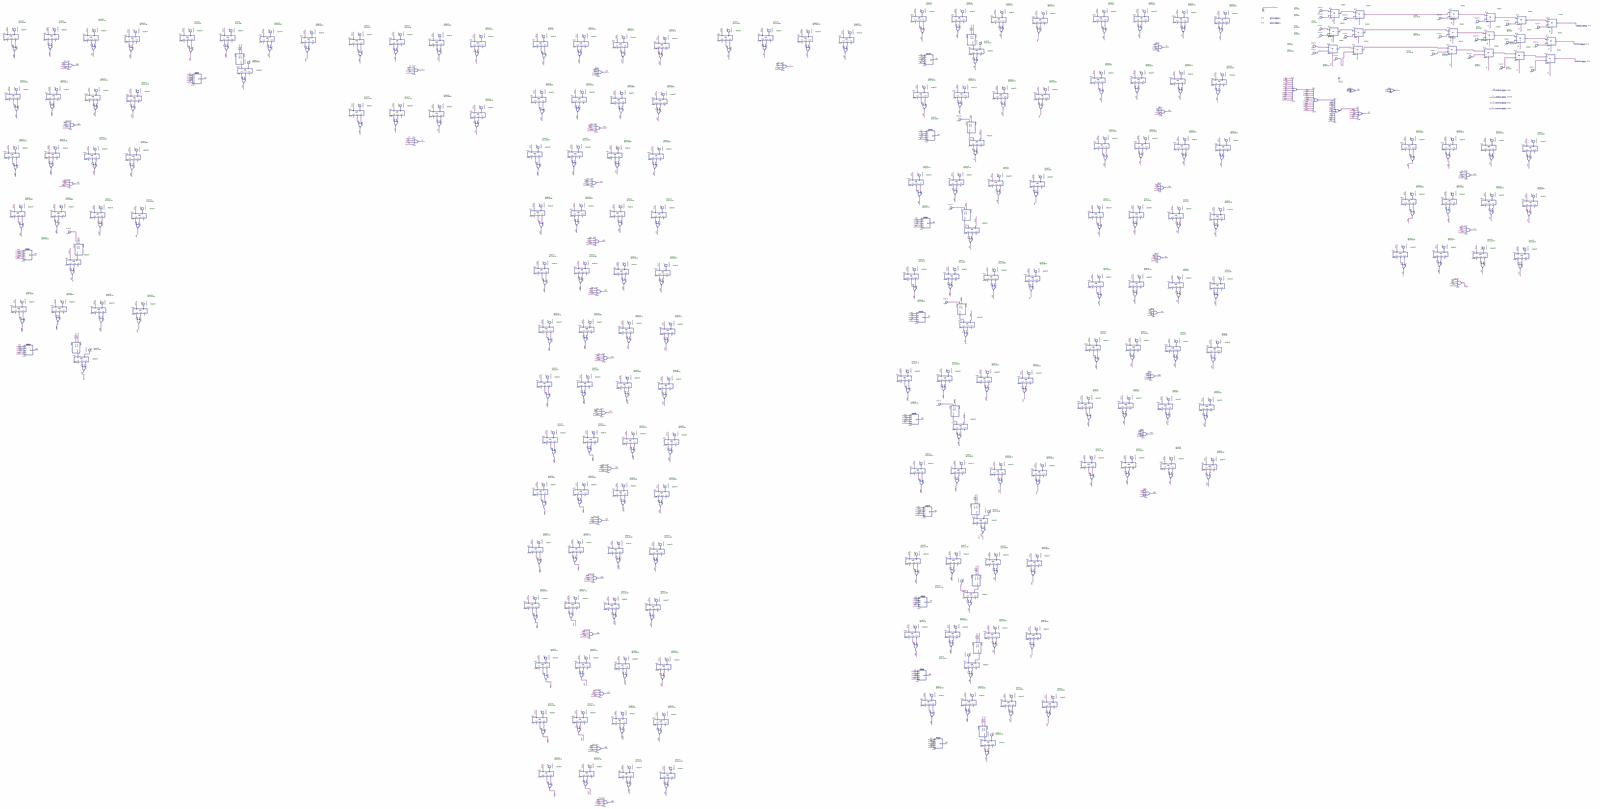
[diagram p0: schematic sheet, whole]
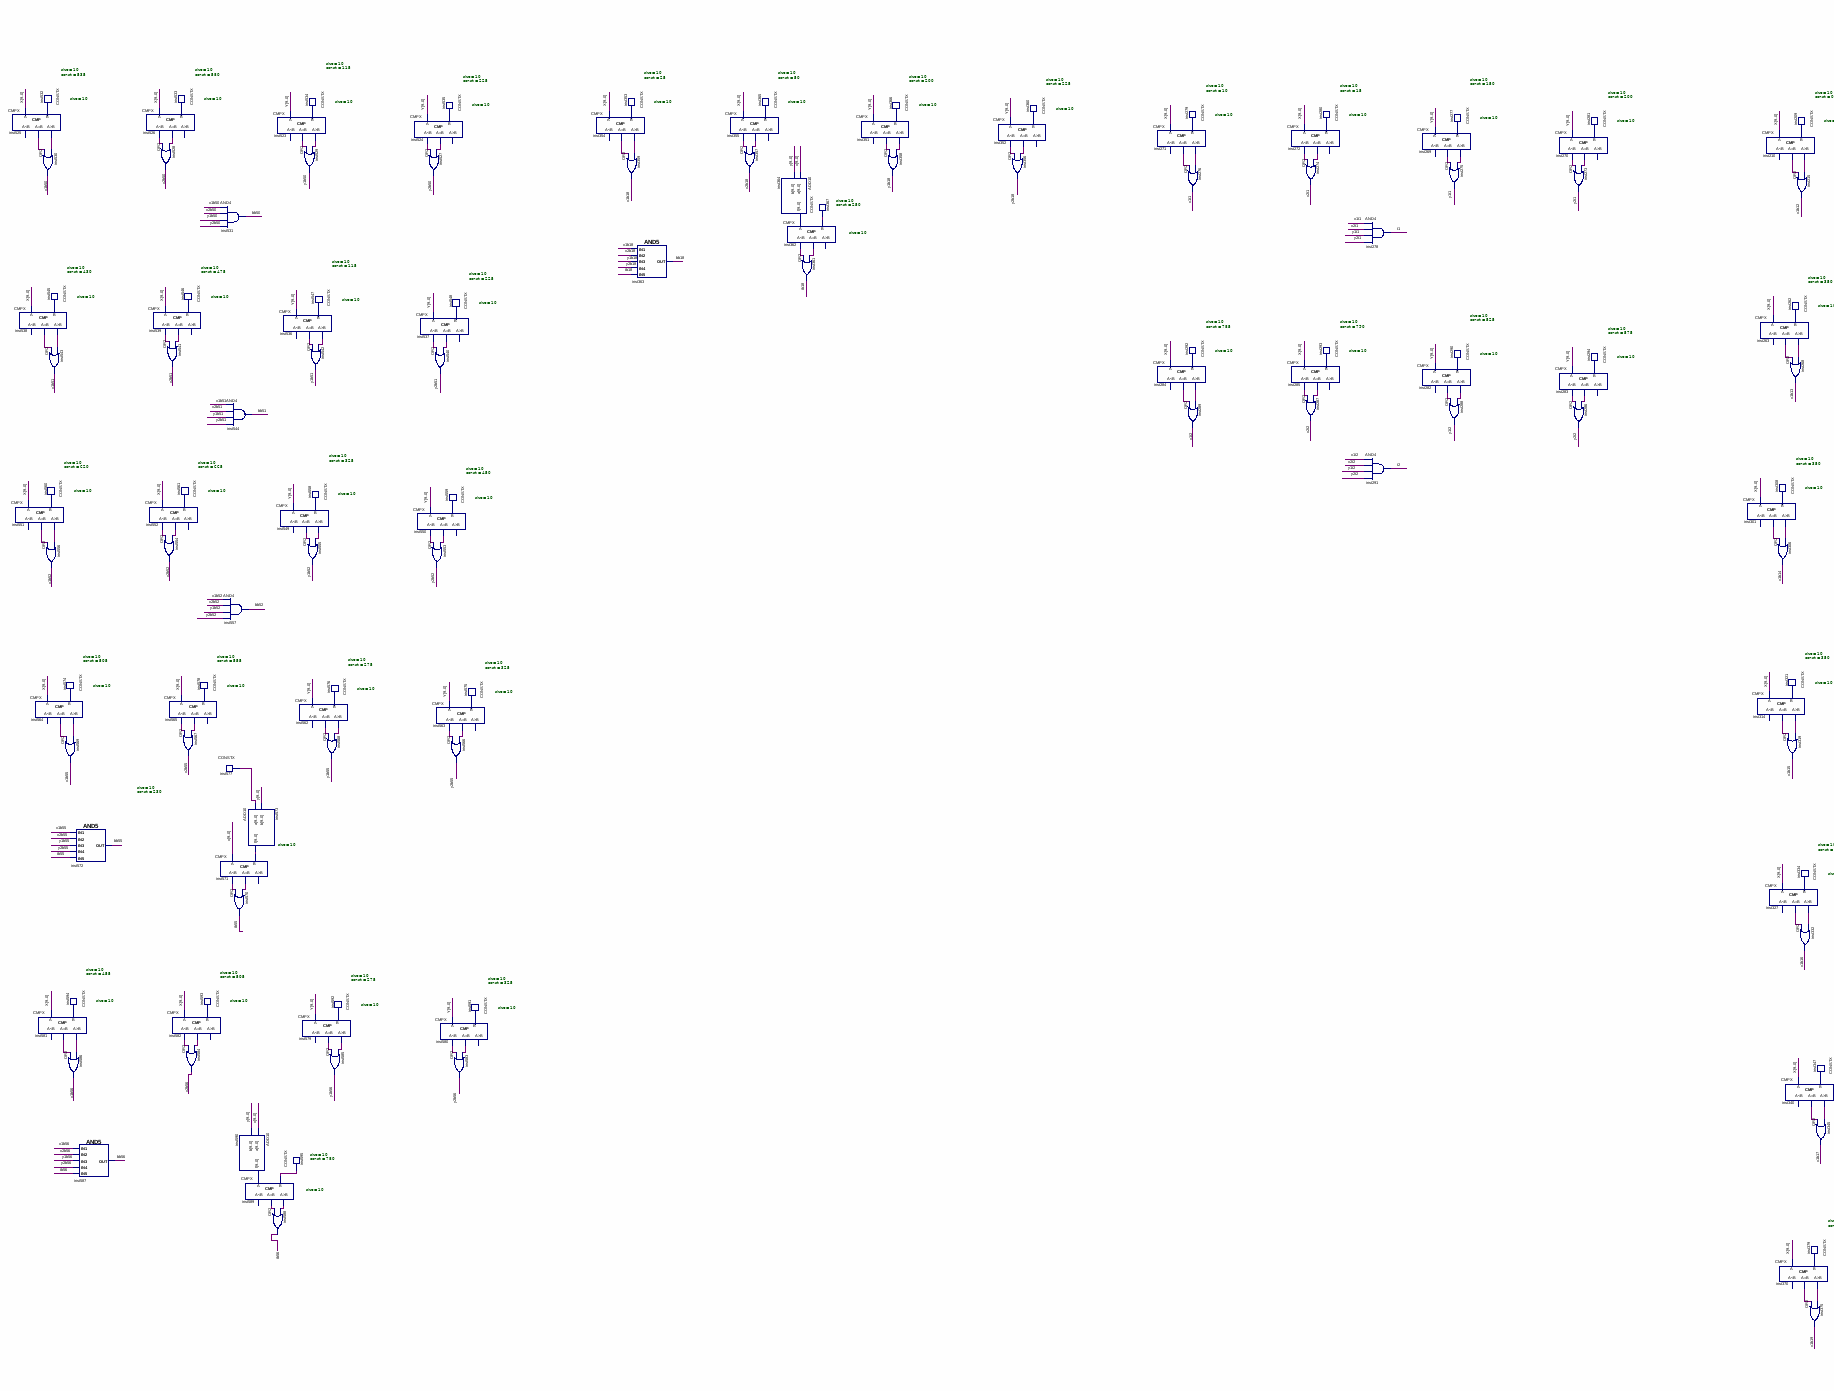
[diagram p1: schematic sheet, upper left part]
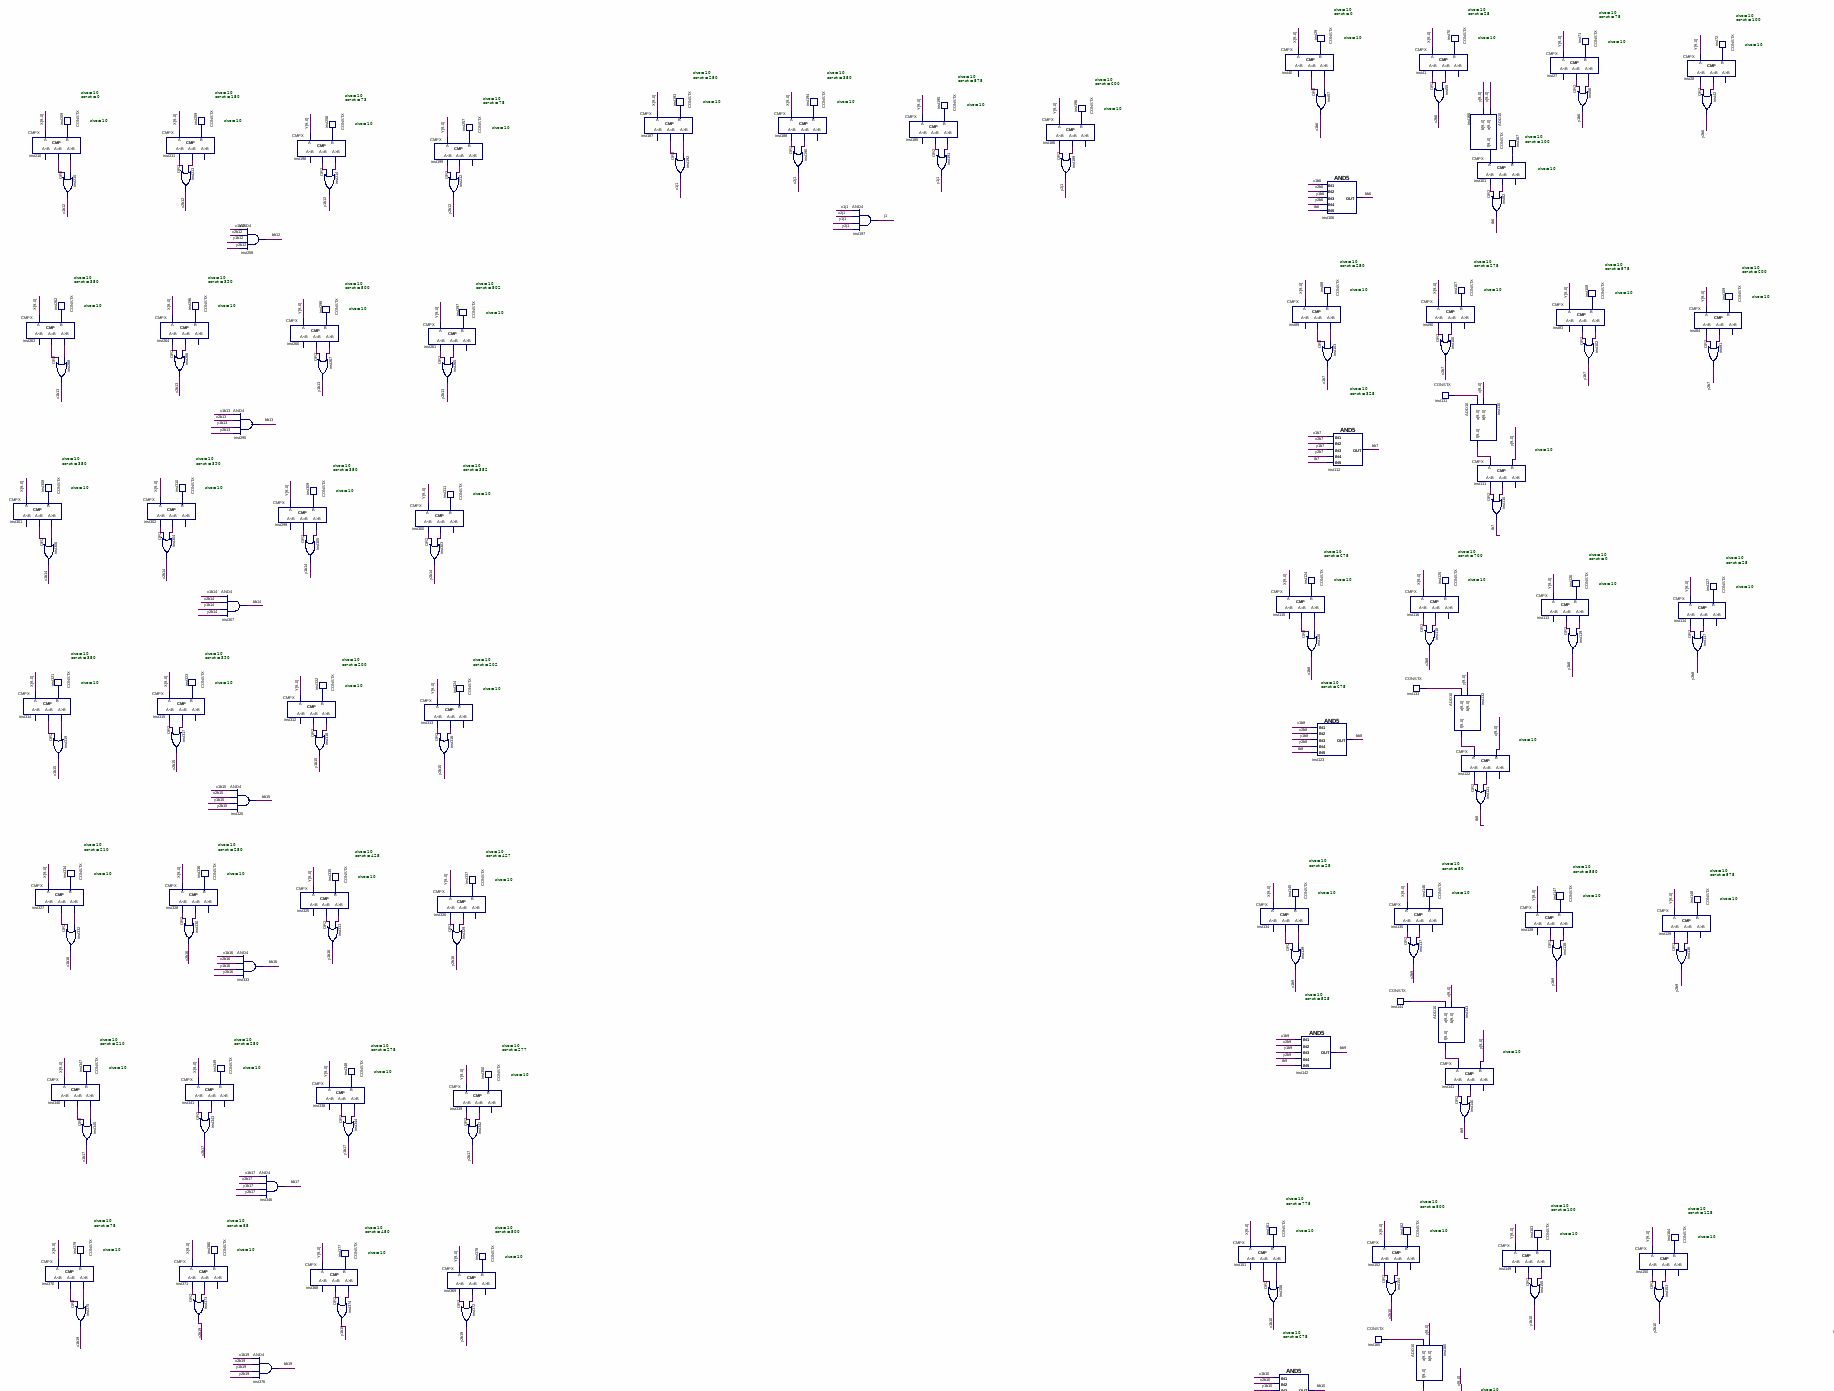
[diagram p2: schematic sheet, upper centre part]
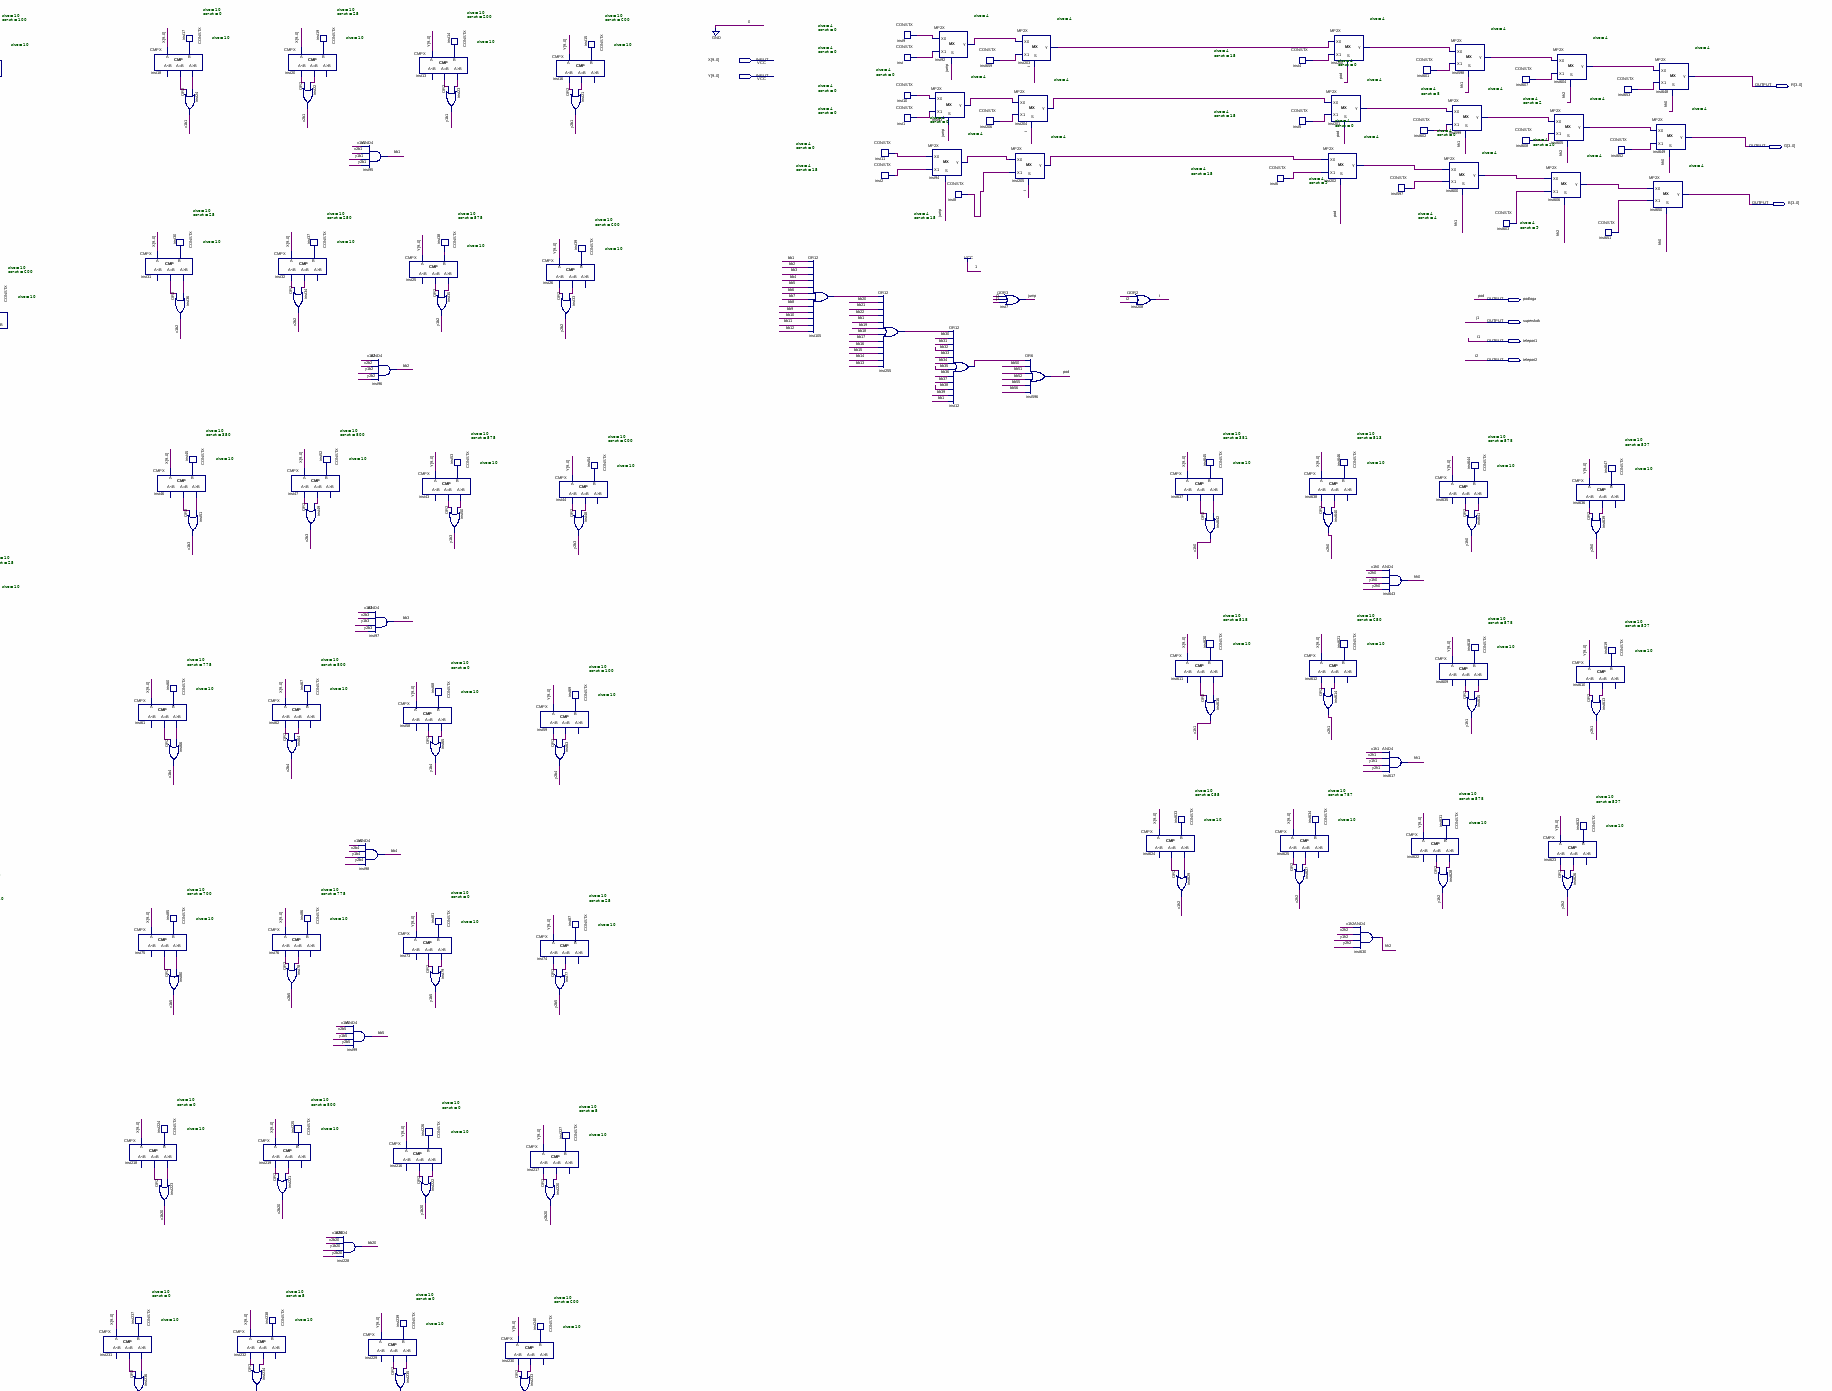
[diagram p3: schematic sheet, upper right part]
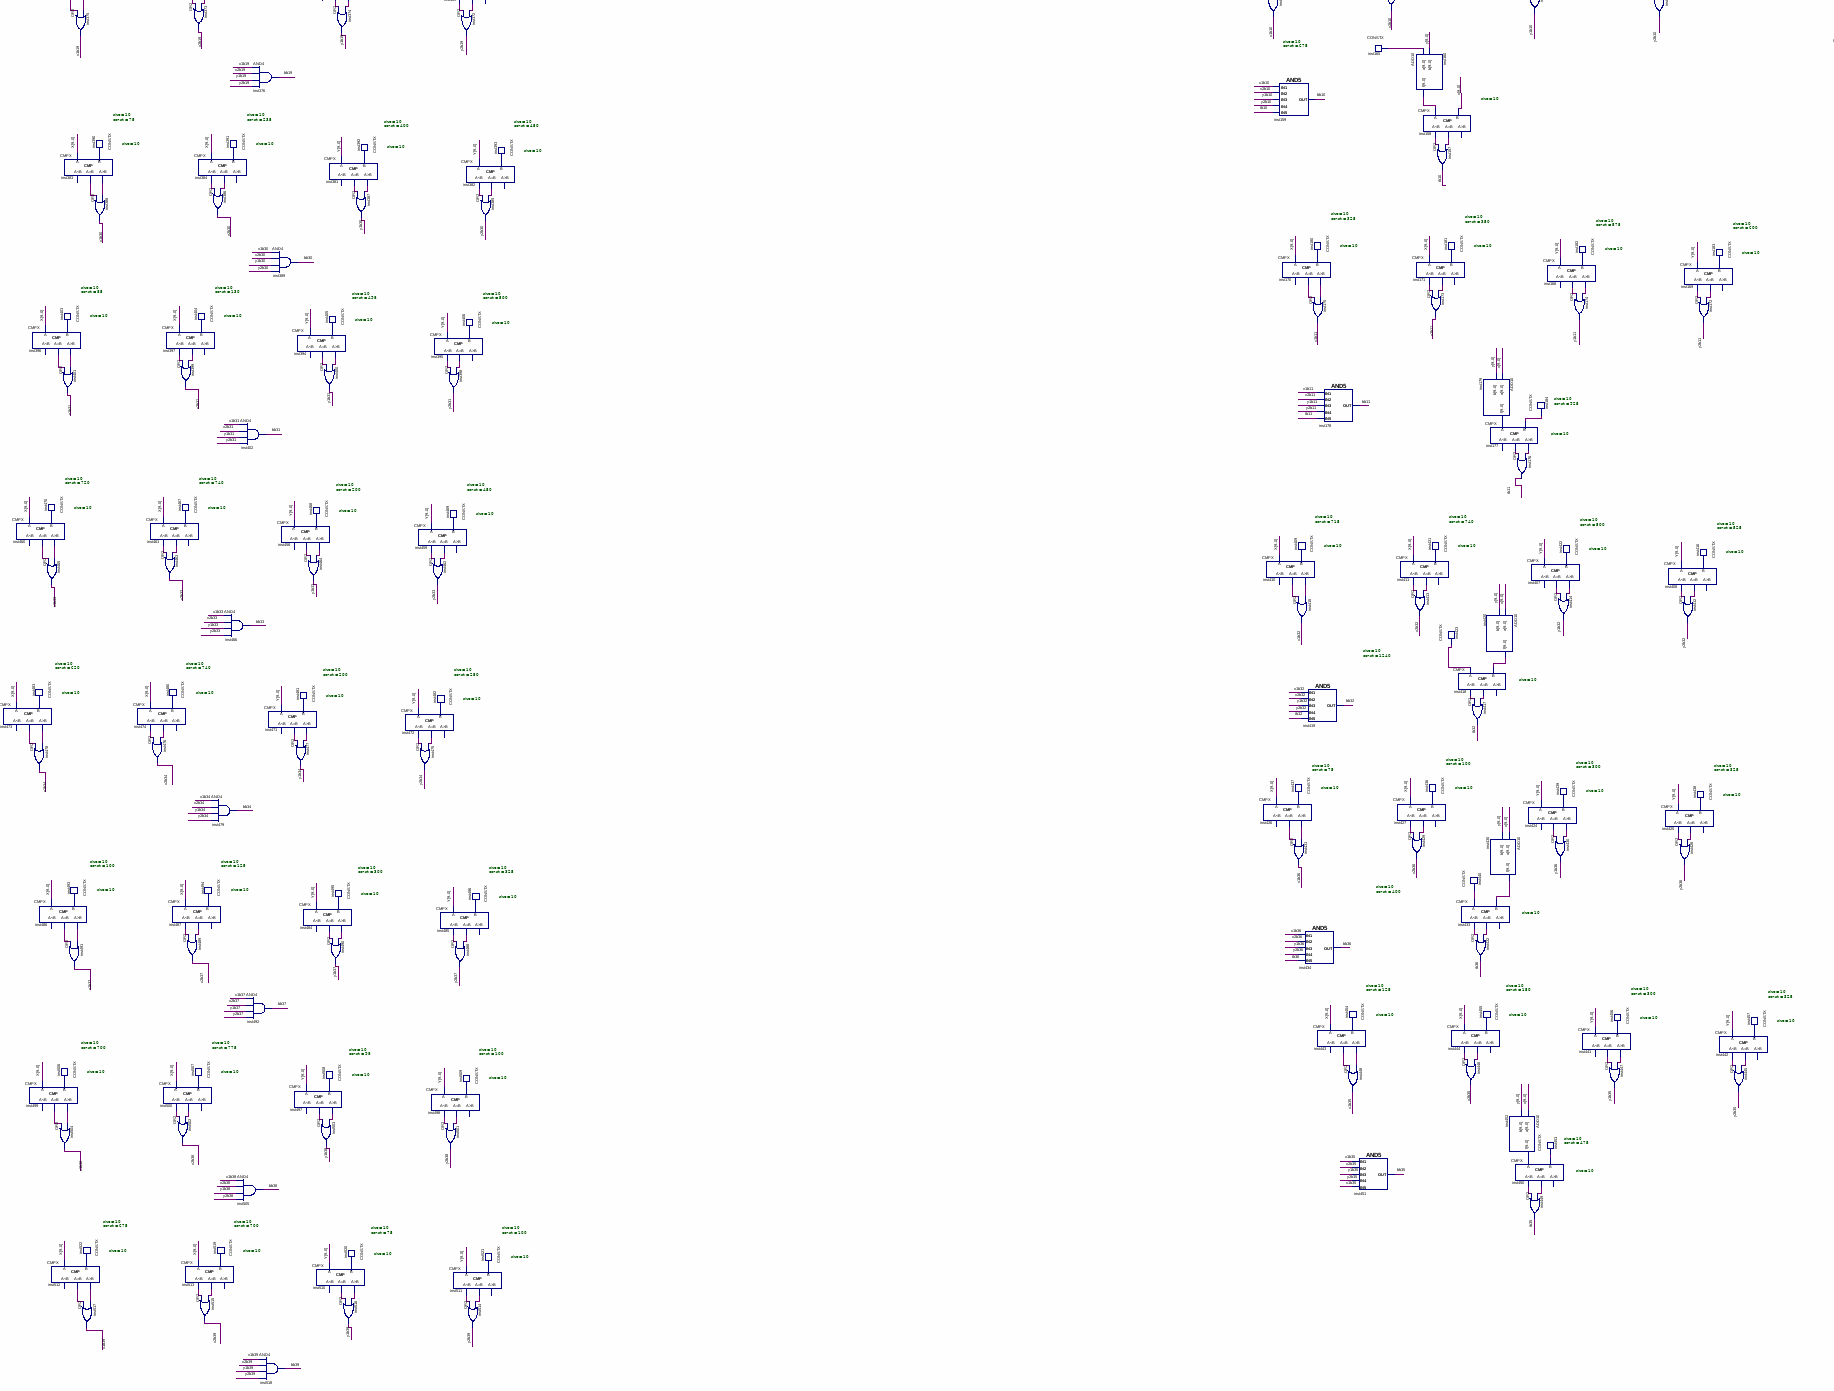
[diagram p4: schematic sheet, lower centre part]
// Quartus schematic Layer0.bdf as structural Verilog: 652 symbols, 9 pins
module Layer0 (
  input  [9:0] X,
  input  [9:0] Y,
  output [3:0] R,
  output [3:0] G,
  output [3:0] B,
  output podloga,
  output superskok,
  output teleport1,
  output teleport2
);

  wire bb1, bb2, bb3, bb4, bb5, bb6, bb7, bb8, bb9, bb10, bb11, bb12, bb13, bb14, bb15, bb16, bb17, bb18,
       bb19, bb20, bb21, bb22, bb30, bb31, bb32, bb33, bb34, bb35, bb36, bb37, bb38, bb39, bb50, bb51, bb52,
       bb55, bb56, hh0, hh1, hh2, inst12_out, inst13_eq, inst13_gr, inst16_eq, inst16_ls, inst18_eq,
       inst18_gr, inst20_eq, inst20_ls, inst25_eq, inst25_gr, inst26_eq, inst26_ls, inst27_eq, inst27_gr,
       inst28_eq, inst28_ls, inst31_eq, inst31_gr, inst32_eq, inst32_ls, inst40_eq, inst40_gr, inst41_eq,
       inst41_ls, inst43_eq, inst43_gr, inst44_eq, inst44_ls, inst46_eq, inst46_gr, inst47_eq, inst47_ls,
       inst58_eq, inst58_gr, inst59_eq, inst59_ls, inst61_eq, inst61_gr, inst62_eq, inst62_ls, inst73_eq,
       inst73_gr, inst74_eq, inst74_ls, inst75_eq, inst75_gr, inst76_eq, inst76_ls, inst83_eq, inst83_gr,
       inst84_eq, inst84_ls, inst89_eq, inst89_gr, inst90_eq, inst90_ls, inst101_eq, inst101_ls, inst105_out,
       inst111_eq, inst111_ls, inst113_eq, inst113_gr, inst114_eq, inst114_ls, inst115_eq, inst115_gr,
       inst116_eq, inst116_ls, inst122_eq, inst122_ls, inst128_eq, inst128_gr, inst129_eq, inst129_ls,
       inst134_eq, inst134_gr, inst135_eq, inst135_ls, inst141_eq, inst141_ls, inst149_eq, inst149_gr,
       inst150_eq, inst150_ls, inst151_eq, inst151_gr, inst152_eq, inst152_ls, inst158_eq, inst158_ls,
       inst168_eq, inst168_gr, inst169_eq, inst169_ls, inst170_eq, inst170_gr, inst171_eq, inst171_ls,
       inst177_eq, inst177_gr, inst185_eq, inst185_gr, inst186_eq, inst186_ls, inst187_eq, inst187_gr,
       inst188_eq, inst188_ls, inst198_eq, inst198_gr, inst199_eq, inst199_ls, inst210_eq, inst210_gr,
       inst211_eq, inst211_ls, inst216_eq, inst216_gr, inst217_eq, inst217_ls, inst218_eq, inst218_gr,
       inst219_eq, inst219_ls, inst229_eq, inst229_gr, inst230_eq, inst230_ls, inst231_eq, inst231_gr,
       inst232_eq, inst232_ls, inst242_eq, inst242_gr, inst243_eq, inst243_ls, inst244_eq, inst244_gr,
       inst245_eq, inst245_ls, inst255_out, inst260_eq, inst260_gr, inst261_eq, inst261_ls, inst263_eq,
       inst263_gr, inst264_eq, inst264_ls, inst269_eq, inst269_gr, inst270_eq, inst270_ls, inst271_eq,
       inst271_gr, inst272_eq, inst272_ls, inst282_eq, inst282_gr, inst283_eq, inst283_ls, inst284_eq,
       inst284_gr, inst285_eq, inst285_ls, inst299_eq, inst299_gr, inst300_eq, inst300_ls, inst301_eq,
       inst301_gr, inst302_eq, inst302_ls, inst312_eq, inst312_gr, inst313_eq, inst313_ls, inst314_eq,
       inst314_gr, inst315_eq, inst315_ls, inst325_eq, inst325_gr, inst326_eq, inst326_ls, inst327_eq,
       inst327_gr, inst328_eq, inst328_ls, inst338_eq, inst338_gr, inst339_eq, inst339_ls, inst340_eq,
       inst340_gr, inst341_eq, inst341_ls, inst351_eq, inst351_gr, inst352_eq, inst352_ls, inst354_eq,
       inst354_gr, inst355_eq, inst355_ls, inst362_eq, inst362_ls, inst368_eq, inst368_gr, inst369_eq,
       inst369_ls, inst370_eq, inst370_gr, inst371_eq, inst371_ls, inst381_eq, inst381_gr, inst382_eq,
       inst382_ls, inst383_eq, inst383_gr, inst384_eq, inst384_ls, inst394_eq, inst394_gr, inst395_eq,
       inst395_ls, inst396_eq, inst396_gr, inst397_eq, inst397_ls, inst407_eq, inst407_gr, inst408_eq,
       inst408_ls, inst410_eq, inst410_gr, inst411_eq, inst411_ls, inst418_eq, inst418_ls, inst424_eq,
       inst424_gr, inst425_eq, inst425_ls, inst426_eq, inst426_gr, inst427_eq, inst427_ls, inst433_eq,
       inst433_ls, inst441_eq, inst441_gr, inst442_eq, inst442_ls, inst443_eq, inst443_gr, inst444_eq,
       inst444_ls, inst450_eq, inst450_ls, inst458_eq, inst458_gr, inst459_eq, inst459_ls, inst460_eq,
       inst460_gr, inst461_eq, inst461_ls, inst471_eq, inst471_gr, inst472_eq, inst472_ls, inst473_eq,
       inst473_gr, inst474_eq, inst474_ls, inst484_eq, inst484_gr, inst485_eq, inst485_ls, inst486_eq,
       inst486_gr, inst487_eq, inst487_ls, inst497_eq, inst497_gr, inst498_eq, inst498_ls, inst499_eq,
       inst499_gr, inst500_eq, inst500_ls, inst510_eq, inst510_gr, inst511_eq, inst511_ls, inst512_eq,
       inst512_gr, inst513_eq, inst513_ls, inst523_eq, inst523_gr, inst524_eq, inst524_ls, inst525_eq,
       inst525_gr, inst526_eq, inst526_ls, inst536_eq, inst536_gr, inst537_eq, inst537_ls, inst538_eq,
       inst538_gr, inst539_eq, inst539_ls, inst549_eq, inst549_gr, inst550_eq, inst550_ls, inst551_eq,
       inst551_gr, inst552_eq, inst552_ls, inst562_eq, inst562_gr, inst563_eq, inst563_ls, inst564_eq,
       inst564_gr, inst565_eq, inst565_ls, inst571_eq, inst571_ls, inst579_eq, inst579_gr, inst580_eq,
       inst580_ls, inst581_eq, inst581_gr, inst582_eq, inst582_ls, inst589_eq, inst589_gr, inst609_eq,
       inst609_gr, inst610_eq, inst610_ls, inst611_eq, inst611_gr, inst612_eq, inst612_ls, inst622_eq,
       inst622_gr, inst623_eq, inst623_ls, inst624_eq, inst624_gr, inst625_eq, inst625_ls, inst635_eq,
       inst635_gr, inst636_eq, inst636_ls, inst637_eq, inst637_gr, inst638_eq, inst638_ls, jump, t, tb6, tb7,
       tb8, tb9, tb10, tb11, tb18, tb32, tb35, tb36, tb55, tb56, x1b1, x1b2, x1b3, x1b4, x1b5, x1b6, x1b7,
       x1b8, x1b9, x1b10, x1b11, x1b12, x1b13, x1b14, x1b15, x1b16, x1b17, x1b18, x1b19, x1b20, x1b21, x1b22,
       x1b30, x1b31, x1b32, x1b33, x1b34, x1b35, x1b36, x1b37, x1b38, x1b39, x1b50, x1b51, x1b52, x1b55,
       x1b56, x1h0, x1h1, x1h2, x1j1, x1t1, x1t2, x2b1, x2b2, x2b3, x2b4, x2b5, x2b6, x2b7, x2b8, x2b9,
       x2b10, x2b11, x2b12, x2b13, x2b14, x2b15, x2b16, x2b17, x2b18, x2b19, x2b20, x2b21, x2b22, x2b30,
       x2b31, x2b32, x2b33, x2b34, x2b35, x2b36, x2b37, x2b38, x2b39, x2b50, x2b51, x2b52, x2b55, x2b56,
       x2h0, x2h1, x2h2, x2j1, x2t1, x2t2, y1b1, y1b2, y1b3, y1b4, y1b5, y1b6, y1b7, y1b8, y1b9, y1b10,
       y1b11, y1b12, y1b13, y1b14, y1b15, y1b16, y1b17, y1b18, y1b19, y1b20, y1b21, y1b22, y1b30, y1b31,
       y1b32, y1b33, y1b34, y1b35, y1b36, y1b37, y1b38, y1b39, y1b50, y1b51, y1b52, y1b55, y1b56, y1h0, y1h1,
       y1h2, y1j1, y1t1, y1t2, y2b1, y2b2, y2b3, y2b4, y2b5, y2b6, y2b7, y2b8, y2b9, y2b10, y2b11, y2b12,
       y2b13, y2b14, y2b15, y2b16, y2b17, y2b18, y2b19, y2b20, y2b21, y2b22, y2b30, y2b31, y2b32, y2b33,
       y2b34, y2b35, y2b36, y2b37, y2b38, y2b39, y2b50, y2b51, y2b52, y2b55, y2b56, y2h0, y2h1, y2h2, y2j1,
       y2t1, y2t2;
  wire [3:0] inst1_data, inst2_data, inst4_data, inst5_data, inst6_data, inst8_data, inst9_data, inst10_data,
       inst11_data, inst92_y, inst93_y, inst94_y, inst200_y, inst201_y, inst202_y, inst203_y, inst204_y,
       inst205_y, inst206_data, inst597_data, inst598_y, inst599_y, inst600_y, inst601_data, inst602_data,
       inst603_data, inst604_y, inst605_y, inst606_y, inst607_data, inst608_data, inst651_data, inst652_data,
       inst653_data, inst659_data, inst_data;
  wire [9:0] inst14_data, inst15_data, inst17_data, inst19_data, inst29_data, inst30_data, inst37_data,
       inst38_data, inst39_data, inst45_data, inst52_data, inst53_data, inst54_data, inst60_data,
       inst67_data, inst68_data, inst69_data, inst70_data, inst71_data, inst72_data, inst81_data,
       inst85_data, inst86_data, inst87_data, inst88_data, inst107_data, inst108_data, inst109_data,
       inst124_data, inst125_data, inst126_data, inst127_data, inst130_f, inst131_data, inst132_f,
       inst133_data, inst143_f, inst144_data, inst145_data, inst146_data, inst147_data, inst148_data,
       inst160_f, inst161_data, inst162_data, inst163_data, inst164_data, inst165_data, inst166_f,
       inst167_data, inst179_f, inst180_data, inst181_data, inst182_data, inst183_data, inst184_data,
       inst193_data, inst194_data, inst195_data, inst196_data, inst209_data, inst224_data, inst225_data,
       inst226_data, inst227_data, inst237_data, inst238_data, inst239_data, inst240_data, inst250_data,
       inst251_data, inst252_data, inst253_data, inst256_data, inst257_data, inst259_data, inst262_data,
       inst277_data, inst279_data, inst280_data, inst281_data, inst290_data, inst292_data, inst293_data,
       inst294_data, inst296_data, inst297_data, inst298_data, inst308_data, inst309_data, inst310_data,
       inst311_data, inst321_data, inst322_data, inst323_data, inst324_data, inst334_data, inst335_data,
       inst336_data, inst337_data, inst347_data, inst348_data, inst349_data, inst350_data, inst353_data,
       inst360_data, inst364_f, inst365_data, inst366_data, inst367_data, inst377_data, inst378_data,
       inst379_data, inst380_data, inst390_data, inst391_data, inst392_data, inst393_data, inst403_data,
       inst404_data, inst405_data, inst406_data, inst409_data, inst416_data, inst420_f, inst421_data,
       inst422_data, inst423_data, inst435_f, inst436_data, inst437_data, inst438_data, inst439_data,
       inst440_data, inst452_f, inst453_data, inst454_data, inst455_data, inst456_data, inst457_data,
       inst467_data, inst468_data, inst469_data, inst470_data, inst480_data, inst481_data, inst482_data,
       inst483_data, inst493_data, inst494_data, inst495_data, inst496_data, inst506_data, inst507_data,
       inst508_data, inst509_data, inst519_data, inst520_data, inst521_data, inst522_data, inst532_data,
       inst533_data, inst534_data, inst535_data, inst545_data, inst546_data, inst547_data, inst548_data,
       inst558_data, inst559_data, inst560_data, inst561_data, inst573_f, inst574_data, inst575_data,
       inst576_data, inst577_data, inst578_data, inst590_f, inst591_data, inst592_data, inst593_data,
       inst594_data, inst595_data, inst618_data, inst619_data, inst620_data, inst621_data, inst631_data,
       inst632_data, inst633_data, inst634_data, inst644_data, inst645_data, inst646_data, inst647_data;

  CMPX #(.size(10)) inst525 (.A(X), .B(inst532_data), .eq(inst525_eq), .gr(inst525_gr));  // open: ls
  CMPX #(.size(10)) inst538 (.A(X), .B(inst545_data), .eq(inst538_eq), .gr(inst538_gr));  // open: ls
  CMPX #(.size(10)) inst551 (.A(X), .B(inst560_data), .eq(inst551_eq), .gr(inst551_gr));  // open: ls
  CONSTX #(.size(10), .\const (535)) inst532 (.data(inst532_data));
  or inst530 (x1b50, inst525_eq, inst525_gr);
  CONSTX #(.size(10), .\const (430)) inst545 (.data(inst545_data));
  or inst543 (x1b51, inst538_eq, inst538_gr);
  CONSTX #(.size(10), .\const (620)) inst560 (.data(inst560_data));
  or inst556 (x1b52, inst551_eq, inst551_gr);
  CMPX #(.size(10)) inst564 (.A(X), .B(inst574_data), .eq(inst564_eq), .gr(inst564_gr));  // open: ls
  CMPX #(.size(10)) inst581 (.A(X), .B(inst594_data), .eq(inst581_eq), .gr(inst581_gr));  // open: ls
  CONSTX #(.size(10), .\const (505)) inst574 (.data(inst574_data));
  or inst569 (x1b55, inst564_eq, inst564_gr);
  and inst572 (bb55, x1b55, x2b55, y1b55, y2b55, tb55);
  CONSTX #(.size(10), .\const (455)) inst594 (.data(inst594_data));
  or inst586 (x1b56, inst581_eq, inst581_gr);
  and inst587 (bb56, x1b56, x2b56, y1b56, y2b56, tb56);
  CMPX #(.size(10)) inst526 (.A(X), .B(inst533_data), .ls(inst526_ls), .eq(inst526_eq));  // open: gr
  CMPX #(.size(10)) inst539 (.A(X), .B(inst546_data), .ls(inst539_ls), .eq(inst539_eq));  // open: gr
  CMPX #(.size(10)) inst552 (.A(X), .B(inst561_data), .ls(inst552_ls), .eq(inst552_eq));  // open: gr
  CONSTX #(.size(10), .\const (580)) inst533 (.data(inst533_data));
  or inst528 (x2b50, inst526_ls, inst526_eq);
  or inst541 (x2b51, inst539_ls, inst539_eq);
  or inst554 (x2b52, inst552_ls, inst552_eq);
  CMPX #(.size(10)) inst565 (.A(X), .B(inst578_data), .ls(inst565_ls), .eq(inst565_eq));  // open: gr
  CMPX #(.size(10)) inst582 (.A(X), .B(inst593_data), .ls(inst582_ls), .eq(inst582_eq));  // open: gr
  CONSTX #(.size(10), .\const (475)) inst546 (.data(inst546_data));
  CONSTX #(.size(10), .\const (665)) inst561 (.data(inst561_data));
  CONSTX #(.size(10), .\const (555)) inst578 (.data(inst578_data));
  or inst567 (x2b55, inst565_ls, inst565_eq);
  CONSTX #(.size(10), .\const (505)) inst593 (.data(inst593_data));
  or inst584 (x2b56, inst582_ls, inst582_eq);
  and inst531 (bb50, x1b50, x2b50, y1b50, y2b50);
  and inst557 (bb52, x1b52, x2b52, y1b52, y2b52);
  CONSTX #(.size(10), .\const (230)) inst577 (.data(inst577_data));
  CMPX #(.size(10)) inst571 (.A(X), .B(inst573_f), .ls(inst571_ls), .eq(inst571_eq));  // open: gr
  and inst544 (bb51, x1b51, x2b51, y1b51, y2b51);
  ADD10 inst573 (.a(inst577_data), .b(Y), .f(inst573_f));
  or inst570 (tb55, inst571_ls, inst571_eq);
  ADD10 inst590 (.a(X), .b(Y), .f(inst590_f));
  CMPX #(.size(10)) inst589 (.A(inst590_f), .B(inst595_data), .eq(inst589_eq), .gr(inst589_gr));  // open: ls
  CMPX #(.size(10)) inst523 (.A(Y), .B(inst534_data), .eq(inst523_eq), .gr(inst523_gr));  // open: ls
  CMPX #(.size(10)) inst549 (.A(Y), .B(inst558_data), .eq(inst549_eq), .gr(inst549_gr));  // open: ls
  or inst588 (tb56, inst589_eq, inst589_gr);
  or inst529 (y1b50, inst523_eq, inst523_gr);
  CMPX #(.size(10)) inst536 (.A(Y), .B(inst547_data), .eq(inst536_eq), .gr(inst536_gr));  // open: ls
  CMPX #(.size(10)) inst562 (.A(Y), .B(inst576_data), .eq(inst562_eq), .gr(inst562_gr));  // open: ls
  CMPX #(.size(10)) inst579 (.A(Y), .B(inst592_data), .eq(inst579_eq), .gr(inst579_gr));  // open: ls
  CONSTX #(.size(10), .\const (780)) inst595 (.data(inst595_data));
  CONSTX #(.size(10), .\const (115)) inst534 (.data(inst534_data));
  CONSTX #(.size(10), .\const (115)) inst547 (.data(inst547_data));
  or inst542 (y1b51, inst536_eq, inst536_gr);
  CONSTX #(.size(10), .\const (325)) inst558 (.data(inst558_data));
  or inst555 (y1b52, inst549_eq, inst549_gr);
  CONSTX #(.size(10), .\const (275)) inst576 (.data(inst576_data));
  or inst568 (y1b55, inst562_eq, inst562_gr);
  or inst585 (y1b56, inst579_eq, inst579_gr);
  CONSTX #(.size(10), .\const (275)) inst592 (.data(inst592_data));
  CMPX #(.size(10)) inst524 (.A(Y), .B(inst535_data), .ls(inst524_ls), .eq(inst524_eq));  // open: gr
  or inst527 (y2b50, inst524_ls, inst524_eq);
  CMPX #(.size(10)) inst537 (.A(Y), .B(inst548_data), .ls(inst537_ls), .eq(inst537_eq));  // open: gr
  CMPX #(.size(10)) inst550 (.A(Y), .B(inst559_data), .ls(inst550_ls), .eq(inst550_eq));  // open: gr
  or inst553 (y2b52, inst550_ls, inst550_eq);
  CONSTX #(.size(10), .\const (225)) inst535 (.data(inst535_data));
  CONSTX #(.size(10), .\const (225)) inst548 (.data(inst548_data));
  or inst540 (y2b51, inst537_ls, inst537_eq);
  CONSTX #(.size(10), .\const (450)) inst559 (.data(inst559_data));
  CMPX #(.size(10)) inst563 (.A(Y), .B(inst575_data), .ls(inst563_ls), .eq(inst563_eq));  // open: gr
  or inst566 (y2b55, inst563_ls, inst563_eq);
  CMPX #(.size(10)) inst580 (.A(Y), .B(inst591_data), .ls(inst580_ls), .eq(inst580_eq));  // open: gr
  or inst583 (y2b56, inst580_ls, inst580_eq);
  CONSTX #(.size(10), .\const (325)) inst575 (.data(inst575_data));
  CONSTX #(.size(10), .\const (325)) inst591 (.data(inst591_data));
  CMPX #(.size(10)) inst354 (.A(X), .B(inst353_data), .eq(inst354_eq), .gr(inst354_gr));  // open: ls
  CONSTX #(.size(10), .\const (25)) inst353 (.data(inst353_data));
  or inst359 (x1b18, inst354_eq, inst354_gr);
  and inst363 (bb18, x1b18, x2b18, y1b18, y2b18, tb18);
  CMPX #(.size(10)) inst355 (.A(X), .B(inst365_data), .ls(inst355_ls), .eq(inst355_eq));  // open: gr
  CONSTX #(.size(10), .\const (50)) inst365 (.data(inst365_data));
  or inst357 (x2b18, inst355_ls, inst355_eq);
  ADD10 inst364 (.a(X), .b(Y), .f(inst364_f));
  CMPX #(.size(10)) inst362 (.A(inst364_f), .B(inst367_data), .ls(inst362_ls), .eq(inst362_eq));  // open: gr
  CONSTX #(.size(10), .\const (250)) inst367 (.data(inst367_data));
  or inst361 (tb18, inst362_ls, inst362_eq);
  CMPX #(.size(10)) inst351 (.A(Y), .B(inst366_data), .eq(inst351_eq), .gr(inst351_gr));  // open: ls
  CONSTX #(.size(10), .\const (200)) inst366 (.data(inst366_data));
  or inst358 (y1b18, inst351_eq, inst351_gr);
  CMPX #(.size(10)) inst352 (.A(Y), .B(inst360_data), .ls(inst352_ls), .eq(inst352_eq));  // open: gr
  or inst356 (y2b18, inst352_ls, inst352_eq);
  CONSTX #(.size(10), .\const (225)) inst360 (.data(inst360_data));
  CMPX #(.size(10)) inst271 (.A(X), .B(inst279_data), .eq(inst271_eq), .gr(inst271_gr));  // open: ls
  CMPX #(.size(10)) inst284 (.A(X), .B(inst292_data), .eq(inst284_eq), .gr(inst284_gr));  // open: ls
  CONSTX #(.size(10), .\const (10)) inst279 (.data(inst279_data));
  or inst276 (x1t1, inst271_eq, inst271_gr);
  CONSTX #(.size(10), .\const (785)) inst292 (.data(inst292_data));
  or inst289 (x1t2, inst284_eq, inst284_gr);
  CMPX #(.size(10)) inst272 (.A(X), .B(inst280_data), .ls(inst272_ls), .eq(inst272_eq));  // open: gr
  CMPX #(.size(10)) inst285 (.A(X), .B(inst293_data), .ls(inst285_ls), .eq(inst285_eq));  // open: gr
  CONSTX #(.size(10), .\const (15)) inst280 (.data(inst280_data));
  or inst274 (x2t1, inst272_ls, inst272_eq);
  CONSTX #(.size(10), .\const (790)) inst293 (.data(inst293_data));
  or inst287 (x2t2, inst285_ls, inst285_eq);
  and inst278 (teleport1, x1t1, x2t1, y1t1, y2t1);
  and inst291 (teleport2, x1t2, x2t2, y1t2, y2t2);
  CMPX #(.size(10)) inst269 (.A(Y), .B(inst277_data), .eq(inst269_eq), .gr(inst269_gr));  // open: ls
  CMPX #(.size(10)) inst282 (.A(Y), .B(inst290_data), .eq(inst282_eq), .gr(inst282_gr));  // open: ls
  CONSTX #(.size(10), .\const (150)) inst277 (.data(inst277_data));
  or inst275 (y1t1, inst269_eq, inst269_gr);
  CONSTX #(.size(10), .\const (525)) inst290 (.data(inst290_data));
  or inst288 (y1t2, inst282_eq, inst282_gr);
  CMPX #(.size(10)) inst270 (.A(Y), .B(inst281_data), .ls(inst270_ls), .eq(inst270_eq));  // open: gr
  or inst273 (y2t1, inst270_ls, inst270_eq);
  CMPX #(.size(10)) inst283 (.A(Y), .B(inst294_data), .ls(inst283_ls), .eq(inst283_eq));  // open: gr
  or inst286 (y2t2, inst283_ls, inst283_eq);
  CONSTX #(.size(10), .\const (200)) inst281 (.data(inst281_data));
  CONSTX #(.size(10), .\const (575)) inst294 (.data(inst294_data));
  CMPX #(.size(10)) inst263 (.A(X), .B(inst262_data), .eq(inst263_eq), .gr(inst263_gr));  // open: ls
  CMPX #(.size(10)) inst301 (.A(X), .B(inst308_data), .eq(inst301_eq), .gr(inst301_gr));  // open: ls
  CMPX #(.size(10)) inst314 (.A(X), .B(inst321_data), .eq(inst314_eq), .gr(inst314_gr));  // open: ls
  CMPX #(.size(10)) inst460 (.A(X), .B(inst470_data), .eq(inst460_eq), .gr(inst460_gr));  // open: ls
  CMPX #(.size(10)) inst473 (.A(X), .B(inst483_data), .eq(inst473_eq), .gr(inst473_gr));  // open: ls
  CMPX #(.size(10)) inst210 (.A(X), .B(inst209_data), .eq(inst210_eq), .gr(inst210_gr));  // open: ls
  CONSTX #(.size(10), .\const (350)) inst308 (.data(inst308_data));
  or inst306 (x1b14, inst301_eq, inst301_gr);
  CMPX #(.size(10)) inst327 (.A(X), .B(inst334_data), .eq(inst327_eq), .gr(inst327_gr));  // open: ls
  CMPX #(.size(10)) inst340 (.A(X), .B(inst347_data), .eq(inst340_eq), .gr(inst340_gr));  // open: ls
  CMPX #(.size(10)) inst370 (.A(X), .B(inst379_data), .eq(inst370_eq), .gr(inst370_gr));  // open: ls
  CMPX #(.size(10)) inst396 (.A(X), .B(inst403_data), .eq(inst396_eq), .gr(inst396_gr));  // open: ls
  CONSTX #(.size(10), .\const (720)) inst470 (.data(inst470_data));
  or inst465 (x1b33, inst460_eq, inst460_gr);
  CONSTX #(.size(10), .\const (620)) inst483 (.data(inst483_data));
  or inst478 (x1b34, inst473_eq, inst473_gr);
  CMPX #(.size(10)) inst486 (.A(X), .B(inst493_data), .eq(inst486_eq), .gr(inst486_gr));  // open: ls
  CMPX #(.size(10)) inst499 (.A(X), .B(inst506_data), .eq(inst499_eq), .gr(inst499_gr));  // open: ls
  CMPX #(.size(10)) inst512 (.A(X), .B(inst522_data), .eq(inst512_eq), .gr(inst512_gr));  // open: ls
  CONSTX #(.size(10), .\const (0)) inst209 (.data(inst209_data));
  or inst215 (x1b12, inst210_eq, inst210_gr);
  CONSTX #(.size(10), .\const (350)) inst262 (.data(inst262_data));
  or inst268 (x1b13, inst263_eq, inst263_gr);
  CONSTX #(.size(10), .\const (350)) inst321 (.data(inst321_data));
  or inst319 (x1b15, inst314_eq, inst314_gr);
  CONSTX #(.size(10), .\const (210)) inst334 (.data(inst334_data));
  or inst332 (x1b16, inst327_eq, inst327_gr);
  CONSTX #(.size(10), .\const (75)) inst379 (.data(inst379_data));
  or inst375 (x1b19, inst370_eq, inst370_gr);
  CMPX #(.size(10)) inst383 (.A(X), .B(inst390_data), .eq(inst383_eq), .gr(inst383_gr));  // open: ls
  CONSTX #(.size(10), .\const (85)) inst403 (.data(inst403_data));
  or inst401 (x1b31, inst396_eq, inst396_gr);
  CONSTX #(.size(10), .\const (100)) inst493 (.data(inst493_data));
  or inst491 (x1b37, inst486_eq, inst486_gr);
  CONSTX #(.size(10), .\const (700)) inst506 (.data(inst506_data));
  or inst504 (x1b38, inst499_eq, inst499_gr);
  CONSTX #(.size(10), .\const (210)) inst347 (.data(inst347_data));
  or inst345 (x1b17, inst340_eq, inst340_gr);
  CONSTX #(.size(10), .\const (75)) inst390 (.data(inst390_data));
  or inst388 (x1b30, inst383_eq, inst383_gr);
  CONSTX #(.size(10), .\const (675)) inst522 (.data(inst522_data));
  or inst517 (x1b39, inst512_eq, inst512_gr);
  CMPX #(.size(10)) inst302 (.A(X), .B(inst310_data), .ls(inst302_ls), .eq(inst302_eq));  // open: gr
  CMPX #(.size(10)) inst461 (.A(X), .B(inst467_data), .ls(inst461_ls), .eq(inst461_eq));  // open: gr
  CMPX #(.size(10)) inst474 (.A(X), .B(inst480_data), .ls(inst474_ls), .eq(inst474_eq));  // open: gr
  or inst476 (x2b34, inst474_ls, inst474_eq);
  CMPX #(.size(10)) inst211 (.A(X), .B(inst259_data), .ls(inst211_ls), .eq(inst211_eq));  // open: gr
  CMPX #(.size(10)) inst264 (.A(X), .B(inst296_data), .ls(inst264_ls), .eq(inst264_eq));  // open: gr
  or inst266 (x2b13, inst264_ls, inst264_eq);
  CONSTX #(.size(10), .\const (390)) inst310 (.data(inst310_data));
  or inst304 (x2b14, inst302_ls, inst302_eq);
  CMPX #(.size(10)) inst315 (.A(X), .B(inst323_data), .ls(inst315_ls), .eq(inst315_eq));  // open: gr
  or inst317 (x2b15, inst315_ls, inst315_eq);
  CMPX #(.size(10)) inst328 (.A(X), .B(inst336_data), .ls(inst328_ls), .eq(inst328_eq));  // open: gr
  CMPX #(.size(10)) inst371 (.A(X), .B(inst380_data), .ls(inst371_ls), .eq(inst371_eq));  // open: gr
  CMPX #(.size(10)) inst397 (.A(X), .B(inst404_data), .ls(inst397_ls), .eq(inst397_eq));  // open: gr
  or inst463 (x2b33, inst461_ls, inst461_eq);
  CONSTX #(.size(10), .\const (740)) inst480 (.data(inst480_data));
  CMPX #(.size(10)) inst487 (.A(X), .B(inst494_data), .ls(inst487_ls), .eq(inst487_eq));  // open: gr
  CMPX #(.size(10)) inst500 (.A(X), .B(inst507_data), .ls(inst500_ls), .eq(inst500_eq));  // open: gr
  or inst502 (x2b38, inst500_ls, inst500_eq);
  CONSTX #(.size(10), .\const (150)) inst259 (.data(inst259_data));
  or inst213 (x2b12, inst211_ls, inst211_eq);
  CONSTX #(.size(10), .\const (390)) inst296 (.data(inst296_data));
  CONSTX #(.size(10), .\const (390)) inst323 (.data(inst323_data));
  CONSTX #(.size(10), .\const (250)) inst336 (.data(inst336_data));
  or inst330 (x2b16, inst328_ls, inst328_eq);
  CMPX #(.size(10)) inst341 (.A(X), .B(inst349_data), .ls(inst341_ls), .eq(inst341_eq));  // open: gr
  or inst343 (x2b17, inst341_ls, inst341_eq);
  or inst373 (x2b19, inst371_ls, inst371_eq);
  CMPX #(.size(10)) inst384 (.A(X), .B(inst391_data), .ls(inst384_ls), .eq(inst384_eq));  // open: gr
  CONSTX #(.size(10), .\const (130)) inst404 (.data(inst404_data));
  or inst399 (x2b31, inst397_ls, inst397_eq);
  CONSTX #(.size(10), .\const (740)) inst467 (.data(inst467_data));
  CONSTX #(.size(10), .\const (125)) inst494 (.data(inst494_data));
  or inst489 (x2b37, inst487_ls, inst487_eq);
  CONSTX #(.size(10), .\const (775)) inst507 (.data(inst507_data));
  CMPX #(.size(10)) inst513 (.A(X), .B(inst519_data), .ls(inst513_ls), .eq(inst513_eq));  // open: gr
  or inst515 (x2b39, inst513_ls, inst513_eq);
  and inst307 (bb14, x1b14, x2b14, y1b14, y2b14);
  CONSTX #(.size(10), .\const (250)) inst349 (.data(inst349_data));
  CONSTX #(.size(10), .\const (85)) inst380 (.data(inst380_data));
  CONSTX #(.size(10), .\const (235)) inst391 (.data(inst391_data));
  or inst386 (x2b30, inst384_ls, inst384_eq);
  and inst466 (bb33, x1b33, x2b33, y1b33, y2b33);
  and inst479 (bb34, x1b34, x2b34, y1b34, y2b34);
  CONSTX #(.size(10), .\const (700)) inst519 (.data(inst519_data));
  and inst258 (bb12, x1b12, x2b12, y1b12, y2b12);
  and inst295 (bb13, x1b13, x2b13, y1b13, y2b13);
  and inst320 (bb15, x1b15, x2b15, y1b15, y2b15);
  and inst333 (bb16, x1b16, x2b16, y1b16, y2b16);
  and inst402 (bb31, x1b31, x2b31, y1b31, y2b31);
  and inst492 (bb37, x1b37, x2b37, y1b37, y2b37);
  and inst505 (bb38, x1b38, x2b38, y1b38, y2b38);
  CMPX #(.size(10)) inst299 (.A(Y), .B(inst309_data), .eq(inst299_eq), .gr(inst299_gr));  // open: ls
  and inst346 (bb17, x1b17, x2b17, y1b17, y2b17);
  and inst376 (bb19, x1b19, x2b19, y1b19, y2b19);
  and inst389 (bb30, x1b30, x2b30, y1b30, y2b30);
  CMPX #(.size(10)) inst458 (.A(Y), .B(inst468_data), .eq(inst458_eq), .gr(inst458_gr));  // open: ls
  CMPX #(.size(10)) inst471 (.A(Y), .B(inst481_data), .eq(inst471_eq), .gr(inst471_gr));  // open: ls
  and inst518 (bb39, x1b39, x2b39, y1b39, y2b39);
  CMPX #(.size(10)) inst198 (.A(Y), .B(inst256_data), .eq(inst198_eq), .gr(inst198_gr));  // open: ls
  CMPX #(.size(10)) inst260 (.A(Y), .B(inst298_data), .eq(inst260_eq), .gr(inst260_gr));  // open: ls
  or inst305 (y1b14, inst299_eq, inst299_gr);
  CMPX #(.size(10)) inst312 (.A(Y), .B(inst322_data), .eq(inst312_eq), .gr(inst312_gr));  // open: ls
  CMPX #(.size(10)) inst325 (.A(Y), .B(inst335_data), .eq(inst325_eq), .gr(inst325_gr));  // open: ls
  CMPX #(.size(10)) inst394 (.A(Y), .B(inst405_data), .eq(inst394_eq), .gr(inst394_gr));  // open: ls
  CONSTX #(.size(10), .\const (200)) inst481 (.data(inst481_data));
  or inst477 (y1b34, inst471_eq, inst471_gr);
  CMPX #(.size(10)) inst484 (.A(Y), .B(inst495_data), .eq(inst484_eq), .gr(inst484_gr));  // open: ls
  CMPX #(.size(10)) inst497 (.A(Y), .B(inst508_data), .eq(inst497_eq), .gr(inst497_gr));  // open: ls
  CONSTX #(.size(10), .\const (73)) inst256 (.data(inst256_data));
  or inst214 (y1b12, inst198_eq, inst198_gr);
  CONSTX #(.size(10), .\const (500)) inst298 (.data(inst298_data));
  or inst267 (y1b13, inst260_eq, inst260_gr);
  CONSTX #(.size(10), .\const (350)) inst309 (.data(inst309_data));
  CONSTX #(.size(10), .\const (200)) inst322 (.data(inst322_data));
  or inst318 (y1b15, inst312_eq, inst312_gr);
  CONSTX #(.size(10), .\const (425)) inst335 (.data(inst335_data));
  or inst331 (y1b16, inst325_eq, inst325_gr);
  CMPX #(.size(10)) inst338 (.A(Y), .B(inst348_data), .eq(inst338_eq), .gr(inst338_gr));  // open: ls
  CMPX #(.size(10)) inst368 (.A(Y), .B(inst377_data), .eq(inst368_eq), .gr(inst368_gr));  // open: ls
  CMPX #(.size(10)) inst381 (.A(Y), .B(inst392_data), .eq(inst381_eq), .gr(inst381_gr));  // open: ls
  CONSTX #(.size(10), .\const (498)) inst405 (.data(inst405_data));
  or inst400 (y1b31, inst394_eq, inst394_gr);
  CONSTX #(.size(10), .\const (200)) inst468 (.data(inst468_data));
  or inst464 (y1b33, inst458_eq, inst458_gr);
  or inst490 (y1b37, inst484_eq, inst484_gr);
  CONSTX #(.size(10), .\const (98)) inst508 (.data(inst508_data));
  or inst503 (y1b38, inst497_eq, inst497_gr);
  CMPX #(.size(10)) inst510 (.A(Y), .B(inst520_data), .eq(inst510_eq), .gr(inst510_gr));  // open: ls
  CONSTX #(.size(10), .\const (275)) inst348 (.data(inst348_data));
  or inst344 (y1b17, inst338_eq, inst338_gr);
  CONSTX #(.size(10), .\const (450)) inst377 (.data(inst377_data));
  or inst374 (y1b19, inst368_eq, inst368_gr);
  or inst387 (y1b30, inst381_eq, inst381_gr);
  CONSTX #(.size(10), .\const (300)) inst495 (.data(inst495_data));
  CONSTX #(.size(10), .\const (75)) inst520 (.data(inst520_data));
  or inst516 (y1b39, inst510_eq, inst510_gr);
  CONSTX #(.size(10), .\const (400)) inst392 (.data(inst392_data));
  CMPX #(.size(10)) inst472 (.A(Y), .B(inst482_data), .ls(inst472_ls), .eq(inst472_eq));  // open: gr
  CMPX #(.size(10)) inst199 (.A(Y), .B(inst257_data), .ls(inst199_ls), .eq(inst199_eq));  // open: gr
  CMPX #(.size(10)) inst261 (.A(Y), .B(inst297_data), .ls(inst261_ls), .eq(inst261_eq));  // open: gr
  CMPX #(.size(10)) inst300 (.A(Y), .B(inst311_data), .ls(inst300_ls), .eq(inst300_eq));  // open: gr
  or inst303 (y2b14, inst300_ls, inst300_eq);
  CMPX #(.size(10)) inst313 (.A(Y), .B(inst324_data), .ls(inst313_ls), .eq(inst313_eq));  // open: gr
  CMPX #(.size(10)) inst395 (.A(Y), .B(inst406_data), .ls(inst395_ls), .eq(inst395_eq));  // open: gr
  CMPX #(.size(10)) inst459 (.A(Y), .B(inst469_data), .ls(inst459_ls), .eq(inst459_eq));  // open: gr
  or inst462 (y2b33, inst459_ls, inst459_eq);
  or inst475 (y2b34, inst472_ls, inst472_eq);
  CMPX #(.size(10)) inst498 (.A(Y), .B(inst509_data), .ls(inst498_ls), .eq(inst498_eq));  // open: gr
  or inst212 (y2b12, inst199_ls, inst199_eq);
  CONSTX #(.size(10), .\const (502)) inst297 (.data(inst297_data));
  or inst265 (y2b13, inst261_ls, inst261_eq);
  CONSTX #(.size(10), .\const (352)) inst311 (.data(inst311_data));
  CONSTX #(.size(10), .\const (202)) inst324 (.data(inst324_data));
  or inst316 (y2b15, inst313_ls, inst313_eq);
  CMPX #(.size(10)) inst326 (.A(Y), .B(inst337_data), .ls(inst326_ls), .eq(inst326_eq));  // open: gr
  or inst329 (y2b16, inst326_ls, inst326_eq);
  CMPX #(.size(10)) inst339 (.A(Y), .B(inst350_data), .ls(inst339_ls), .eq(inst339_eq));  // open: gr
  CMPX #(.size(10)) inst369 (.A(Y), .B(inst378_data), .ls(inst369_ls), .eq(inst369_eq));  // open: gr
  or inst398 (y2b31, inst395_ls, inst395_eq);
  CONSTX #(.size(10), .\const (450)) inst469 (.data(inst469_data));
  CONSTX #(.size(10), .\const (250)) inst482 (.data(inst482_data));
  CMPX #(.size(10)) inst485 (.A(Y), .B(inst496_data), .ls(inst485_ls), .eq(inst485_eq));  // open: gr
  or inst488 (y2b37, inst485_ls, inst485_eq);
  or inst501 (y2b38, inst498_ls, inst498_eq);
  CMPX #(.size(10)) inst511 (.A(Y), .B(inst521_data), .ls(inst511_ls), .eq(inst511_eq));  // open: gr
  CONSTX #(.size(10), .\const (75)) inst257 (.data(inst257_data));
  CONSTX #(.size(10), .\const (427)) inst337 (.data(inst337_data));
  CONSTX #(.size(10), .\const (277)) inst350 (.data(inst350_data));
  or inst342 (y2b17, inst339_ls, inst339_eq);
  CONSTX #(.size(10), .\const (500)) inst378 (.data(inst378_data));
  or inst372 (y2b19, inst369_ls, inst369_eq);
  CMPX #(.size(10)) inst382 (.A(Y), .B(inst393_data), .ls(inst382_ls), .eq(inst382_eq));  // open: gr
  or inst385 (y2b30, inst382_ls, inst382_eq);
  CONSTX #(.size(10), .\const (500)) inst406 (.data(inst406_data));
  CONSTX #(.size(10), .\const (325)) inst496 (.data(inst496_data));
  CONSTX #(.size(10), .\const (100)) inst509 (.data(inst509_data));
  CONSTX #(.size(10), .\const (100)) inst521 (.data(inst521_data));
  or inst514 (y2b39, inst511_ls, inst511_eq);
  CONSTX #(.size(10), .\const (450)) inst393 (.data(inst393_data));
  CMPX #(.size(10)) inst187 (.A(X), .B(inst193_data), .eq(inst187_eq), .gr(inst187_gr));  // open: ls
  CONSTX #(.size(10), .\const (250)) inst193 (.data(inst193_data));
  or inst192 (x1j1, inst187_eq, inst187_gr);
  CMPX #(.size(10)) inst188 (.A(X), .B(inst194_data), .ls(inst188_ls), .eq(inst188_eq));  // open: gr
  CONSTX #(.size(10), .\const (350)) inst194 (.data(inst194_data));
  or inst190 (x2j1, inst188_ls, inst188_eq);
  and inst197 (superskok, x1j1, x2j1, y1j1, y2j1);
  CMPX #(.size(10)) inst185 (.A(Y), .B(inst195_data), .eq(inst185_eq), .gr(inst185_gr));  // open: ls
  CONSTX #(.size(10), .\const (575)) inst195 (.data(inst195_data));
  or inst191 (y1j1, inst185_eq, inst185_gr);
  CMPX #(.size(10)) inst186 (.A(Y), .B(inst196_data), .ls(inst186_ls), .eq(inst186_eq));  // open: gr
  or inst189 (y2j1, inst186_ls, inst186_eq);
  CONSTX #(.size(10), .\const (600)) inst196 (.data(inst196_data));
  CMPX #(.size(10)) inst151 (.A(X), .B(inst161_data), .eq(inst151_eq), .gr(inst151_gr));  // open: ls
  CMPX #(.size(10)) inst115 (.A(X), .B(inst124_data), .eq(inst115_eq), .gr(inst115_gr));  // open: ls
  CMPX #(.size(10)) inst134 (.A(X), .B(inst145_data), .eq(inst134_eq), .gr(inst134_gr));  // open: ls
  CONSTX #(.size(10), .\const (775)) inst161 (.data(inst161_data));
  or inst156 (x1b10, inst151_eq, inst151_gr);
  CMPX #(.size(10)) inst410 (.A(X), .B(inst409_data), .eq(inst410_eq), .gr(inst410_gr));  // open: ls
  CMPX #(.size(10)) inst426 (.A(X), .B(inst437_data), .eq(inst426_eq), .gr(inst426_gr));  // open: ls
  CMPX #(.size(10)) inst40 (.A(X), .B(inst29_data), .eq(inst40_eq), .gr(inst40_gr));  // open: ls
  CMPX #(.size(10)) inst89 (.A(X), .B(inst88_data), .eq(inst89_eq), .gr(inst89_gr));  // open: ls
  CONSTX #(.size(10), .\const (25)) inst145 (.data(inst145_data));
  or inst139 (x1b9, inst134_eq, inst134_gr);
  and inst142 (bb9, x1b9, x2b9, y1b9, y2b9, tb9);
  and inst159 (bb10, x1b10, x2b10, y1b10, y2b10, tb10);
  CMPX #(.size(10)) inst170 (.A(X), .B(inst180_data), .eq(inst170_eq), .gr(inst170_gr));  // open: ls
  CONSTX #(.size(10), .\const (715)) inst409 (.data(inst409_data));
  or inst415 (x1b32, inst410_eq, inst410_gr);
  CONSTX #(.size(10), .\const (75)) inst437 (.data(inst437_data));
  or inst431 (x1b36, inst426_eq, inst426_gr);
  CONSTX #(.size(10), .\const (0)) inst29 (.data(inst29_data));
  or inst57 (x1b6, inst40_eq, inst40_gr);
  and inst106 (bb6, x1b6, x2b6, y1b6, y2b6, tb6);
  CONSTX #(.size(10), .\const (250)) inst88 (.data(inst88_data));
  or inst103 (x1b7, inst89_eq, inst89_gr);
  CONSTX #(.size(10), .\const (675)) inst124 (.data(inst124_data));
  or inst120 (x1b8, inst115_eq, inst115_gr);
  and inst123 (bb8, x1b8, x2b8, y1b8, y2b8, tb8);
  CONSTX #(.size(10), .\const (325)) inst180 (.data(inst180_data));
  or inst175 (x1b11, inst170_eq, inst170_gr);
  and inst178 (bb11, x1b11, x2b11, y1b11, y2b11, tb11);
  and inst419 (bb32, x1b32, x2b32, y1b32, y2b32, tb32);
  and inst434 (bb36, x1b36, x2b36, y1b36, y2b36, tb36);
  CMPX #(.size(10)) inst443 (.A(X), .B(inst454_data), .eq(inst443_eq), .gr(inst443_gr));  // open: ls
  and inst112 (bb7, x1b7, x2b7, y1b7, y2b7, tb7);
  CONSTX #(.size(10), .\const (125)) inst454 (.data(inst454_data));
  or inst448 (x1b35, inst443_eq, inst443_gr);
  CMPX #(.size(10)) inst152 (.A(X), .B(inst162_data), .ls(inst152_ls), .eq(inst152_eq));  // open: gr
  CONSTX #(.size(10), .\const (675)) inst165 (.data(inst165_data));
  and inst451 (bb35, x1b35, x2b35, y1b35, y2b35, x1b35);
  CMPX #(.size(10)) inst135 (.A(X), .B(inst146_data), .ls(inst135_ls), .eq(inst135_eq));  // open: gr
  CONSTX #(.size(10), .\const (525)) inst144 (.data(inst144_data));
  CONSTX #(.size(10), .\const (800)) inst162 (.data(inst162_data));
  or inst154 (x2b10, inst152_ls, inst152_eq);
  CMPX #(.size(10)) inst411 (.A(X), .B(inst421_data), .ls(inst411_ls), .eq(inst411_eq));  // open: gr
  CMPX #(.size(10)) inst427 (.A(X), .B(inst436_data), .ls(inst427_ls), .eq(inst427_eq));  // open: gr
  CMPX #(.size(10)) inst41 (.A(X), .B(inst70_data), .ls(inst41_ls), .eq(inst41_eq));  // open: gr
  CMPX #(.size(10)) inst90 (.A(X), .B(inst107_data), .ls(inst90_ls), .eq(inst90_eq));  // open: gr
  CMPX #(.size(10)) inst116 (.A(X), .B(inst125_data), .ls(inst116_ls), .eq(inst116_eq));  // open: gr
  or inst118 (x2b8, inst116_ls, inst116_eq);
  CONSTX #(.size(10), .\const (675)) inst133 (.data(inst133_data));
  CONSTX #(.size(10), .\const (50)) inst146 (.data(inst146_data));
  or inst137 (x2b9, inst135_ls, inst135_eq);
  ADD10 inst160 (.a(inst165_data), .b(Y), .f(inst160_f));
  CMPX #(.size(10)) inst158 (.A(inst160_f), .B(X), .ls(inst158_ls), .eq(inst158_eq));  // open: gr
  CMPX #(.size(10)) inst171 (.A(X), .B(inst181_data), .ls(inst171_ls), .eq(inst171_eq));  // open: gr
  or inst413 (x2b32, inst411_ls, inst411_eq);
  CONSTX #(.size(10), .\const (100)) inst436 (.data(inst436_data));
  or inst429 (x2b36, inst427_ls, inst427_eq);
  CONSTX #(.size(10), .\const (25)) inst70 (.data(inst70_data));
  or inst55 (x2b6, inst41_ls, inst41_eq);
  or inst100 (x2b7, inst90_ls, inst90_eq);
  CONSTX #(.size(10), .\const (325)) inst131 (.data(inst131_data));
  CONSTX #(.size(10), .\const (700)) inst125 (.data(inst125_data));
  ADD10 inst132 (.a(inst133_data), .b(Y), .f(inst132_f));
  ADD10 inst143 (.a(inst144_data), .b(X), .f(inst143_f));
  CMPX #(.size(10)) inst141 (.A(inst143_f), .B(Y), .ls(inst141_ls), .eq(inst141_eq));  // open: gr
  or inst157 (tb10, inst158_ls, inst158_eq);
  CONSTX #(.size(10), .\const (350)) inst181 (.data(inst181_data));
  or inst173 (x2b11, inst171_ls, inst171_eq);
  CONSTX #(.size(10), .\const (740)) inst421 (.data(inst421_data));
  CONSTX #(.size(10), .\const (1240)) inst423 (.data(inst423_data));
  CMPX #(.size(10)) inst444 (.A(X), .B(inst455_data), .ls(inst444_ls), .eq(inst444_eq));  // open: gr
  ADD10 inst166 (.a(X), .b(Y), .f(inst166_f));
  CMPX #(.size(10)) inst101 (.A(inst166_f), .B(inst167_data), .ls(inst101_ls), .eq(inst101_eq));  // open: gr
  CONSTX #(.size(10), .\const (275)) inst107 (.data(inst107_data));
  ADD10 inst130 (.a(inst131_data), .b(X), .f(inst130_f));
  CMPX #(.size(10)) inst111 (.A(inst130_f), .B(Y), .ls(inst111_ls), .eq(inst111_eq));  // open: gr
  CMPX #(.size(10)) inst122 (.A(inst132_f), .B(X), .ls(inst122_ls), .eq(inst122_eq));  // open: gr
  or inst121 (tb8, inst122_ls, inst122_eq);
  or inst140 (tb9, inst141_ls, inst141_eq);
  CMPX #(.size(10)) inst418 (.A(inst423_data), .B(inst420_f), .ls(inst418_ls), .eq(inst418_eq));  // open: gr
  or inst417 (tb32, inst418_ls, inst418_eq);
  CONSTX #(.size(10), .\const (400)) inst440 (.data(inst440_data));
  CMPX #(.size(10)) inst433 (.A(inst440_data), .B(inst435_f), .ls(inst433_ls), .eq(inst433_eq));  // open: gr
  or inst432 (tb36, inst433_ls, inst433_eq);
  or inst446 (x2b35, inst444_ls, inst444_eq);
  CONSTX #(.size(10), .\const (100)) inst167 (.data(inst167_data));
  or inst82 (tb6, inst101_ls, inst101_eq);
  or inst110 (tb7, inst111_ls, inst111_eq);
  CMPX #(.size(10)) inst149 (.A(Y), .B(inst163_data), .eq(inst149_eq), .gr(inst149_gr));  // open: ls
  ADD10 inst179 (.a(X), .b(Y), .f(inst179_f));
  CMPX #(.size(10)) inst177 (.A(inst179_f), .B(inst184_data), .eq(inst177_eq), .gr(inst177_gr));  // open: ls
  ADD10 inst420 (.a(X), .b(Y), .f(inst420_f));
  ADD10 inst435 (.a(X), .b(Y), .f(inst435_f));
  CONSTX #(.size(10), .\const (150)) inst455 (.data(inst455_data));
  CMPX #(.size(10)) inst128 (.A(Y), .B(inst147_data), .eq(inst128_eq), .gr(inst128_gr));  // open: ls
  or inst155 (y1b10, inst149_eq, inst149_gr);
  or inst176 (tb11, inst177_eq, inst177_gr);
  CMPX #(.size(10)) inst407 (.A(Y), .B(inst422_data), .eq(inst407_eq), .gr(inst407_gr));  // open: ls
  CMPX #(.size(10)) inst424 (.A(Y), .B(inst439_data), .eq(inst424_eq), .gr(inst424_gr));  // open: ls
  ADD10 inst452 (.a(X), .b(Y), .f(inst452_f));
  CMPX #(.size(10)) inst450 (.A(inst452_f), .B(inst453_data), .ls(inst450_ls), .eq(inst450_eq));  // open: gr
  or inst449 (tb35, inst450_ls, inst450_eq);
  CMPX #(.size(10)) inst27 (.A(Y), .B(inst71_data), .eq(inst27_eq), .gr(inst27_gr));  // open: ls
  CMPX #(.size(10)) inst83 (.A(Y), .B(inst108_data), .eq(inst83_eq), .gr(inst83_gr));  // open: ls
  CMPX #(.size(10)) inst113 (.A(Y), .B(inst126_data), .eq(inst113_eq), .gr(inst113_gr));  // open: ls
  CONSTX #(.size(10), .\const (550)) inst147 (.data(inst147_data));
  or inst138 (y1b9, inst128_eq, inst128_gr);
  CONSTX #(.size(10), .\const (100)) inst163 (.data(inst163_data));
  CMPX #(.size(10)) inst168 (.A(Y), .B(inst182_data), .eq(inst168_eq), .gr(inst168_gr));  // open: ls
  CONSTX #(.size(10), .\const (925)) inst184 (.data(inst184_data));
  or inst430 (y1b36, inst424_eq, inst424_gr);
  CONSTX #(.size(10), .\const (475)) inst453 (.data(inst453_data));
  CONSTX #(.size(10), .\const (75)) inst71 (.data(inst71_data));
  or inst56 (y1b6, inst27_eq, inst27_gr);
  CONSTX #(.size(10), .\const (0)) inst126 (.data(inst126_data));
  or inst119 (y1b8, inst113_eq, inst113_gr);
  CONSTX #(.size(10), .\const (575)) inst182 (.data(inst182_data));
  or inst174 (y1b11, inst168_eq, inst168_gr);
  CONSTX #(.size(10), .\const (500)) inst422 (.data(inst422_data));
  or inst414 (y1b32, inst407_eq, inst407_gr);
  CONSTX #(.size(10), .\const (300)) inst439 (.data(inst439_data));
  CMPX #(.size(10)) inst441 (.A(Y), .B(inst456_data), .eq(inst441_eq), .gr(inst441_gr));  // open: ls
  CONSTX #(.size(10), .\const (575)) inst108 (.data(inst108_data));
  or inst102 (y1b7, inst83_eq, inst83_gr);
  CONSTX #(.size(10), .\const (300)) inst456 (.data(inst456_data));
  or inst447 (y1b35, inst441_eq, inst441_gr);
  CMPX #(.size(10)) inst150 (.A(Y), .B(inst164_data), .ls(inst150_ls), .eq(inst150_eq));  // open: gr
  or inst153 (y2b10, inst150_ls, inst150_eq);
  CMPX #(.size(10)) inst114 (.A(Y), .B(inst127_data), .ls(inst114_ls), .eq(inst114_eq));  // open: gr
  CMPX #(.size(10)) inst129 (.A(Y), .B(inst148_data), .ls(inst129_ls), .eq(inst129_eq));  // open: gr
  or inst136 (y2b9, inst129_ls, inst129_eq);
  CONSTX #(.size(10), .\const (125)) inst164 (.data(inst164_data));
  CMPX #(.size(10)) inst169 (.A(Y), .B(inst183_data), .ls(inst169_ls), .eq(inst169_eq));  // open: gr
  CMPX #(.size(10)) inst408 (.A(Y), .B(inst416_data), .ls(inst408_ls), .eq(inst408_eq));  // open: gr
  or inst412 (y2b32, inst408_ls, inst408_eq);
  CMPX #(.size(10)) inst425 (.A(Y), .B(inst438_data), .ls(inst425_ls), .eq(inst425_eq));  // open: gr
  or inst428 (y2b36, inst425_ls, inst425_eq);
  CMPX #(.size(10)) inst28 (.A(Y), .B(inst72_data), .ls(inst28_ls), .eq(inst28_eq));  // open: gr
  or inst42 (y2b6, inst28_ls, inst28_eq);
  CMPX #(.size(10)) inst84 (.A(Y), .B(inst109_data), .ls(inst84_ls), .eq(inst84_eq));  // open: gr
  or inst91 (y2b7, inst84_ls, inst84_eq);
  CONSTX #(.size(10), .\const (25)) inst127 (.data(inst127_data));
  or inst117 (y2b8, inst114_ls, inst114_eq);
  CONSTX #(.size(10), .\const (575)) inst148 (.data(inst148_data));
  or inst172 (y2b11, inst169_ls, inst169_eq);
  CONSTX #(.size(10), .\const (525)) inst416 (.data(inst416_data));
  CONSTX #(.size(10), .\const (325)) inst438 (.data(inst438_data));
  CONSTX #(.size(10), .\const (100)) inst72 (.data(inst72_data));
  CONSTX #(.size(10), .\const (600)) inst109 (.data(inst109_data));
  CONSTX #(.size(10), .\const (600)) inst183 (.data(inst183_data));
  CMPX #(.size(10)) inst442 (.A(Y), .B(inst457_data), .ls(inst442_ls), .eq(inst442_eq));  // open: gr
  or inst445 (y2b35, inst442_ls, inst442_eq);
  CONSTX #(.size(10), .\const (325)) inst457 (.data(inst457_data));
  CMPX #(.size(10)) inst231 (.A(X), .B(inst237_data), .eq(inst231_eq), .gr(inst231_gr));  // open: ls
  CMPX #(.size(10)) inst218 (.A(X), .B(inst224_data), .eq(inst218_eq), .gr(inst218_gr));  // open: ls
  CMPX #(.size(10)) inst244 (.A(X), .B(inst250_data), .eq(inst244_eq), .gr(inst244_gr));  // open: ls
  CMPX #(.size(10)) inst18 (.A(X), .B(inst17_data), .eq(inst18_eq), .gr(inst18_gr));  // open: ls
  CMPX #(.size(10)) inst31 (.A(X), .B(inst30_data), .eq(inst31_eq), .gr(inst31_gr));  // open: ls
  CMPX #(.size(10)) inst61 (.A(X), .B(inst60_data), .eq(inst61_eq), .gr(inst61_gr));  // open: ls
  CMPX #(.size(10)) inst75 (.A(X), .B(inst85_data), .eq(inst75_eq), .gr(inst75_gr));  // open: ls
  CONSTX #(.size(10), .\const (0)) inst237 (.data(inst237_data));
  or inst236 (x1b21, inst231_eq, inst231_gr);
  CONSTX #(.size(10), .\const (795)) inst250 (.data(inst250_data));
  or inst249 (x1b22, inst244_eq, inst244_gr);
  CONSTX #(.size(10), .\const (25)) inst30 (.data(inst30_data));
  or inst36 (x1b2, inst31_eq, inst31_gr);
  CMPX #(.size(10)) inst46 (.A(X), .B(inst45_data), .eq(inst46_eq), .gr(inst46_gr));  // open: ls
  CONSTX #(.size(10), .\const (775)) inst60 (.data(inst60_data));
  or inst66 (x1b4, inst61_eq, inst61_gr);
  CONSTX #(.size(10), .\const (700)) inst85 (.data(inst85_data));
  or inst80 (x1b5, inst75_eq, inst75_gr);
  CONSTX #(.size(10), .\const (0)) inst224 (.data(inst224_data));
  or inst223 (x1b20, inst218_eq, inst218_gr);
  CONSTX #(.size(10), .\const (0)) inst17 (.data(inst17_data));
  or inst24 (x1b1, inst18_eq, inst18_gr);
  CONSTX #(.size(10), .\const (350)) inst45 (.data(inst45_data));
  or inst51 (x1b3, inst46_eq, inst46_gr);
  CMPX #(.size(10)) inst232 (.A(X), .B(inst238_data), .ls(inst232_ls), .eq(inst232_eq));  // open: gr
  or inst234 (x2b21, inst232_ls, inst232_eq);
  CMPX #(.size(10)) inst245 (.A(X), .B(inst251_data), .ls(inst245_ls), .eq(inst245_eq));  // open: gr
  CMPX #(.size(10)) inst32 (.A(X), .B(inst37_data), .ls(inst32_ls), .eq(inst32_eq));  // open: gr
  CMPX #(.size(10)) inst62 (.A(X), .B(inst67_data), .ls(inst62_ls), .eq(inst62_eq));  // open: gr
  CMPX #(.size(10)) inst76 (.A(X), .B(inst86_data), .ls(inst76_ls), .eq(inst76_eq));  // open: gr
  CMPX #(.size(10)) inst219 (.A(X), .B(inst225_data), .ls(inst219_ls), .eq(inst219_eq));  // open: gr
  or inst221 (x2b20, inst219_ls, inst219_eq);
  CONSTX #(.size(10), .\const (5)) inst238 (.data(inst238_data));
  CONSTX #(.size(10), .\const (800)) inst251 (.data(inst251_data));
  or inst247 (x2b22, inst245_ls, inst245_eq);
  CMPX #(.size(10)) inst20 (.A(X), .B(inst19_data), .ls(inst20_ls), .eq(inst20_eq));  // open: gr
  or inst22 (x2b1, inst20_ls, inst20_eq);
  or inst34 (x2b2, inst32_ls, inst32_eq);
  CMPX #(.size(10)) inst47 (.A(X), .B(inst52_data), .ls(inst47_ls), .eq(inst47_eq));  // open: gr
  or inst49 (x2b3, inst47_ls, inst47_eq);
  CONSTX #(.size(10), .\const (800)) inst67 (.data(inst67_data));
  or inst64 (x2b4, inst62_ls, inst62_eq);
  CONSTX #(.size(10), .\const (775)) inst86 (.data(inst86_data));
  or inst78 (x2b5, inst76_ls, inst76_eq);
  CONSTX #(.size(10), .\const (800)) inst225 (.data(inst225_data));
  CONSTX #(.size(10), .\const (25)) inst19 (.data(inst19_data));
  CONSTX #(.size(10), .\const (250)) inst37 (.data(inst37_data));
  CONSTX #(.size(10), .\const (800)) inst52 (.data(inst52_data));
  and inst241 (bb21, x1b21, x2b21, y1b21, y2b21);
  and inst254 (bb22, x1b22, x2b22, y1b22, y2b22);
  and inst99 (bb5, x1b5, x2b5, y1b5, y2b5);
  and inst228 (bb20, x1b20, x2b20, y1b20, y2b20);
  and inst95 (bb1, x1b1, x2b1, y1b1, y2b1);
  and inst96 (bb2, x1b2, x2b2, y1b2, y2b2);
  and inst97 (bb3, x1b3, x2b3, y1b3, y2b3);
  and inst98 (bb4, x1b4, x2b4, y1b4, y2b4);
  CMPX #(.size(10)) inst229 (.A(Y), .B(inst239_data), .eq(inst229_eq), .gr(inst229_gr));  // open: ls
  CMPX #(.size(10)) inst242 (.A(Y), .B(inst252_data), .eq(inst242_eq), .gr(inst242_gr));  // open: ls
  CMPX #(.size(10)) inst25 (.A(Y), .B(inst38_data), .eq(inst25_eq), .gr(inst25_gr));  // open: ls
  CMPX #(.size(10)) inst58 (.A(Y), .B(inst68_data), .eq(inst58_eq), .gr(inst58_gr));  // open: ls
  CMPX #(.size(10)) inst73 (.A(Y), .B(inst81_data), .eq(inst73_eq), .gr(inst73_gr));  // open: ls
  CMPX #(.size(10)) inst216 (.A(Y), .B(inst226_data), .eq(inst216_eq), .gr(inst216_gr));  // open: ls
  CONSTX #(.size(10), .\const (0)) inst239 (.data(inst239_data));
  or inst235 (y1b21, inst229_eq, inst229_gr);
  CONSTX #(.size(10), .\const (0)) inst252 (.data(inst252_data));
  or inst248 (y1b22, inst242_eq, inst242_gr);
  CMPX #(.size(10)) inst13 (.A(Y), .B(inst14_data), .eq(inst13_eq), .gr(inst13_gr));  // open: ls
  CMPX #(.size(10)) inst43 (.A(Y), .B(inst53_data), .eq(inst43_eq), .gr(inst43_gr));  // open: ls
  CONSTX #(.size(10), .\const (0)) inst68 (.data(inst68_data));
  or inst65 (y1b4, inst58_eq, inst58_gr);
  CONSTX #(.size(10), .\const (0)) inst81 (.data(inst81_data));
  or inst79 (y1b5, inst73_eq, inst73_gr);
  CONSTX #(.size(10), .\const (0)) inst226 (.data(inst226_data));
  or inst222 (y1b20, inst216_eq, inst216_gr);
  CONSTX #(.size(10), .\const (200)) inst14 (.data(inst14_data));
  or inst23 (y1b1, inst13_eq, inst13_gr);
  CONSTX #(.size(10), .\const (575)) inst38 (.data(inst38_data));
  or inst35 (y1b2, inst25_eq, inst25_gr);
  CONSTX #(.size(10), .\const (575)) inst53 (.data(inst53_data));
  or inst50 (y1b3, inst43_eq, inst43_gr);
  CMPX #(.size(10)) inst230 (.A(Y), .B(inst240_data), .ls(inst230_ls), .eq(inst230_eq));  // open: gr
  CMPX #(.size(10)) inst217 (.A(Y), .B(inst227_data), .ls(inst217_ls), .eq(inst217_eq));  // open: gr
  CONSTX #(.size(10), .\const (600)) inst240 (.data(inst240_data));
  or inst233 (y2b21, inst230_ls, inst230_eq);
  CMPX #(.size(10)) inst243 (.A(Y), .B(inst253_data), .ls(inst243_ls), .eq(inst243_eq));  // open: gr
  or inst246 (y2b22, inst243_ls, inst243_eq);
  CMPX #(.size(10)) inst16 (.A(Y), .B(inst15_data), .ls(inst16_ls), .eq(inst16_eq));  // open: gr
  CMPX #(.size(10)) inst26 (.A(Y), .B(inst39_data), .ls(inst26_ls), .eq(inst26_eq));  // open: gr
  or inst33 (y2b2, inst26_ls, inst26_eq);
  CMPX #(.size(10)) inst44 (.A(Y), .B(inst54_data), .ls(inst44_ls), .eq(inst44_eq));  // open: gr
  CMPX #(.size(10)) inst59 (.A(Y), .B(inst69_data), .ls(inst59_ls), .eq(inst59_eq));  // open: gr
  or inst63 (y2b4, inst59_ls, inst59_eq);
  CMPX #(.size(10)) inst74 (.A(Y), .B(inst87_data), .ls(inst74_ls), .eq(inst74_eq));  // open: gr
  or inst77 (y2b5, inst74_ls, inst74_eq);
  CONSTX #(.size(10), .\const (5)) inst227 (.data(inst227_data));
  or inst220 (y2b20, inst217_ls, inst217_eq);
  CONSTX #(.size(10), .\const (600)) inst253 (.data(inst253_data));
  CONSTX #(.size(10), .\const (600)) inst15 (.data(inst15_data));
  or inst21 (y2b1, inst16_ls, inst16_eq);
  CONSTX #(.size(10), .\const (600)) inst39 (.data(inst39_data));
  or inst48 (y2b3, inst44_ls, inst44_eq);
  CONSTX #(.size(10), .\const (100)) inst69 (.data(inst69_data));
  CONSTX #(.size(10), .\const (25)) inst87 (.data(inst87_data));
  CONSTX #(.size(10), .\const (600)) inst54 (.data(inst54_data));
